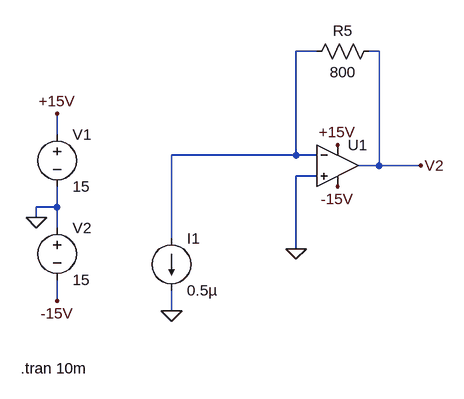
[diagram p0: schematic sim_ex3.asc]
sim_ex3.asc, the LTspice schematic file:
Version 4
SHEET 1 880 680
WIRE 144 -144 112 -144
WIRE 240 -144 224 -144
WIRE -256 -16 -256 -48
WIRE 112 16 112 -144
WIRE 112 16 -80 16
WIRE 144 16 112 16
WIRE 240 32 240 -144
WIRE 240 32 208 32
WIRE 304 32 240 32
WIRE 144 48 112 48
WIRE -256 96 -256 64
WIRE -256 96 -288 96
WIRE -288 112 -288 96
WIRE -256 128 -256 96
WIRE -80 144 -80 16
WIRE 112 160 112 48
WIRE -256 240 -256 208
WIRE -80 256 -80 224
FLAG -288 112 0
FLAG -256 -48 +15V
FLAG -256 240 -15V
FLAG 176 0 +15V
FLAG 176 64 -15V
FLAG 112 160 0
FLAG -80 256 0
FLAG 304 32 V2
SYMBOL OpAmps\\UniversalOpAmp2 176 32 R0
SYMATTR InstName U1
SYMBOL voltage -256 -32 R0
WINDOW 123 0 0 Left 0
WINDOW 39 0 0 Left 0
SYMATTR InstName V1
SYMATTR Value 15
SYMBOL voltage -256 112 R0
WINDOW 123 0 0 Left 0
WINDOW 39 0 0 Left 0
SYMATTR InstName V2
SYMATTR Value 15
SYMBOL res 240 -160 R90
WINDOW 0 0 56 VBottom 2
WINDOW 3 32 56 VTop 2
SYMATTR InstName R5
SYMATTR Value 800
SYMBOL current -80 144 R0
WINDOW 123 0 0 Left 0
WINDOW 39 0 0 Left 0
SYMATTR InstName I1
SYMATTR Value 0.5µ
TEXT -312 344 Left 2 !.tran 10m

The netlist it stands for:
* sim_ex3.asc
XU1 0 N001 +15V -15V V2 level2 Avol=1Meg GBW=10Meg Slew=10Meg Ilimit=25m Rail=0 Vos=0 En=0 Enk=0 In=0 Ink=0 Rin=500Meg  ; pins In+ In- V+ V- OUT
V1 +15V 0 15
V2 0 -15V 15
R5 V2 N001 800
I1 N001 0 0.5µ
.tran 10m
.lib UniversalOpAmp2.lib
.backanno
.end

* Results of the author's LTspice run, read from the files saved beside the schematic
* Operating Point, zero values left out:
*   V(v2) = 400 µV
*   V(+15v) = 15 V
*   V(-15v) = -15 V
*   I(I1) = 500 nA
*   I(R5) = 500 nA
*   I(V2) = -1.498 mA
*   I(V1) = -1.499 mA
*   Ix(u1:3) = 1.499 mA
*   Ix(u1:4) = -1.498 mA
*   Ix(u1:5) = -500 nA